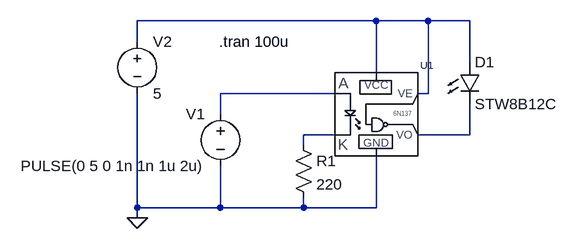
[diagram p0: schematic 6N137-jig.asc]
6N137-jig.asc, the LTspice schematic file:
Version 4
SHEET 1 880 680
WIRE 192 -32 -176 -32
WIRE 272 -32 192 -32
WIRE 336 -32 272 -32
WIRE -176 0 -176 -32
WIRE 336 32 336 -32
WIRE 192 48 192 -32
WIRE 128 80 -48 80
WIRE 272 80 272 -32
WIRE 272 80 256 80
WIRE -48 112 -48 80
WIRE 128 144 80 144
WIRE 336 144 336 96
WIRE 336 144 256 144
WIRE 80 160 80 144
WIRE -176 256 -176 80
WIRE -48 256 -48 192
WIRE -48 256 -176 256
WIRE 80 256 80 240
WIRE 80 256 -48 256
WIRE 192 256 192 176
WIRE 192 256 80 256
WIRE -176 272 -176 256
FLAG -176 272 0
SYMBOL _PERSONAL\\opto\\6N137 192 112 R0
SYMATTR InstName U1
SYMBOL LED 320 32 R0
SYMATTR InstName D1
SYMATTR Value STW8B12C
SYMBOL voltage -48 96 M0
WINDOW 123 0 0 Left 0
WINDOW 39 0 0 Left 0
SYMATTR InstName V1
SYMATTR Value PULSE(0 5 0 1n 1n 1u 2u)
SYMBOL voltage -176 -16 R0
WINDOW 123 0 0 Left 0
WINDOW 39 0 0 Left 0
SYMATTR InstName V2
SYMATTR Value 5
SYMBOL res 64 144 R0
SYMATTR InstName R1
SYMATTR Value 220
TEXT -50 0 Left 2 !.tran 100u

The netlist it stands for:
* 6N137-jig.asc
XU1 N002 N003 0 N004 N001 N001 6N137  ; pins A K GND VO VE VCC
D1 N001 N004 STW8B12C
V1 N002 0 PULSE(0 5 0 1n 1n 1u 2u)
V2 N001 0 5
R1 N003 0 220
.model D D
.lib standard.dio
.tran 100u
.lib ../sym/_PERSONAL/opto/6N137.sub
.backanno
.end